# EAGLE design harduino0.1 (EAGLE 7.4.0)
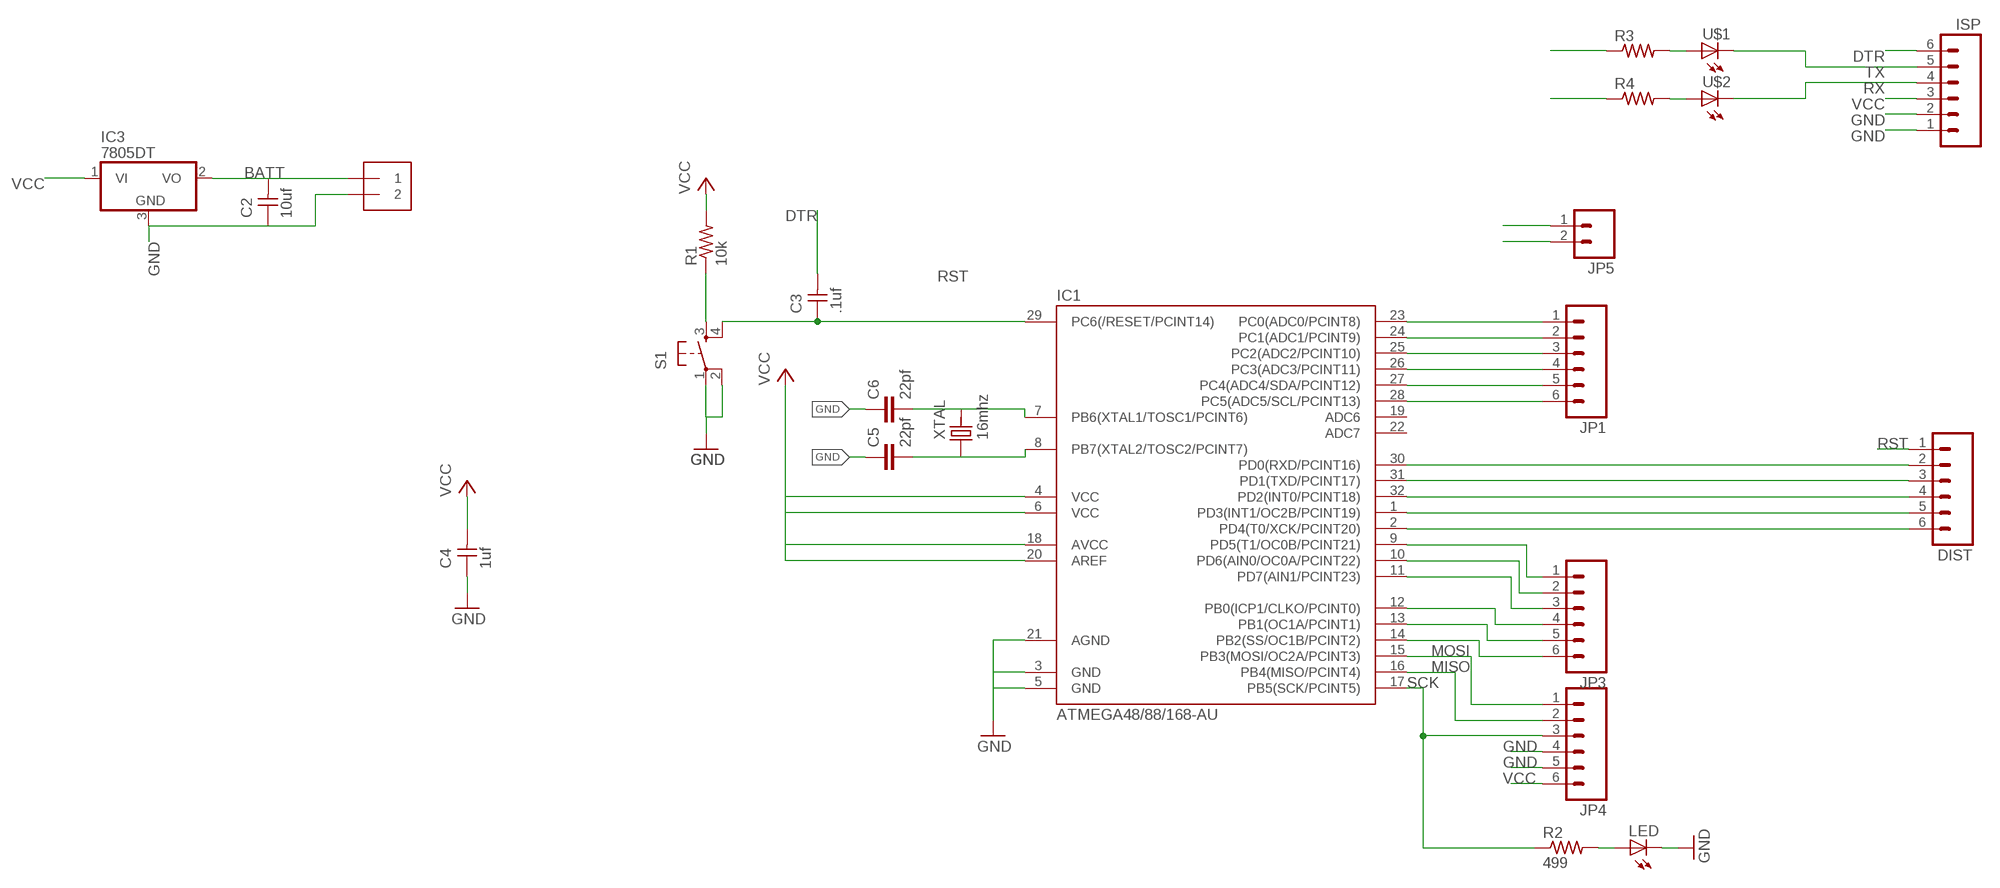
[diagram p0: schematic, sheet 1]

## Parts
C2  10uf  UNPOLARIZED_CAPACITOR1206  [1206]
C3  .1uf  UNPOLARIZED_CAPACITOR1206  [1206]
C4  1uf  UNPOLARIZED_CAPACITOR1206  [1206]
C5  22pf  CAP1206  [1206]
C6  22pf  CAP1206  [1206]
DIST  M06LONGPADS  [1X06_LONGPADS]
IC1  ATMEGA48/88/168-AU  [TQFP32-08]
IC3  7805DT  [TO252]
ISP  M06SMD  [1X06-SMD]
J1  1X2-3.5MM  [3.5MMTERM]
JP1  M06LONGPADS  [1X06_LONGPADS]
JP3  M06LONGPADS  [1X06_LONGPADS]
JP4  M06LONGPADS  [1X06_LONGPADS]
JP5  M02  [1X02_LONGPADS]
LED  LED1206  [1206]
R1  10k  RESISTOR1206  [1206]
R2  499  RESISTOR1206  [1206]
R3  RESISTOR1206  [1206]
R4  RESISTOR1206  [1206]
S1  6MM_SWITCH6MM_SWITCH  [6MM_SWITCH]
U$1  LED1206  [1206]
U$2  LED1206  [1206]
XTAL  16mhz  CRYSTALCS10  [CS10]

## Nets
BATT: C2.2 IC3.2(VO) J1.1
DTR: C3.2 ISP.6
GND: C2.1 C4.1 C5.1 C6.1 IC1.3(GND) IC1.5(GND) IC1.21(AGND) IC3.3(GND) ISP.1 ISP.2 J1.2 JP4.4 JP4.5 JP5.1 LED.2(C) S1.1(P) S1.2(P1)
MISO: IC1.16(PB4(MISO/PCINT4)) JP4.2
MOSI: IC1.15(PB3(MOSI/OC2A/PCINT3)) JP4.1
N$1: C6.2 IC1.7(PB6(XTAL1/TOSC1/PCINT6)) XTAL.P$2
N$2: C5.2 IC1.8(PB7(XTAL2/TOSC2/PCINT7)) XTAL.P$1
N$3: IC1.23(PC0(ADC0/PCINT8)) JP1.1
N$4: IC1.24(PC1(ADC1/PCINT9)) JP1.2
N$5: IC1.25(PC2(ADC2/PCINT10)) JP1.3
N$6: IC1.26(PC3(ADC3/PCINT11)) JP1.4
N$7: IC1.27(PC4(ADC4/SDA/PCINT12)) JP1.5
N$8: IC1.28(PC5(ADC5/SCL/PCINT13)) JP1.6
N$9: DIST.4 IC1.32(PD2(INT0/PCINT18))
N$10: DIST.5 IC1.1(PD3(INT1/OC2B/PCINT19))
N$11: DIST.6 IC1.2(PD4(T0/XCK/PCINT20))
N$12: IC1.9(PD5(T1/OC0B/PCINT21)) JP3.1
N$13: IC1.10(PD6(AIN0/OC0A/PCINT22)) JP3.2
N$14: IC1.11(PD7(AIN1/PCINT23)) JP3.3
N$15: IC1.12(PB0(ICP1/CLKO/PCINT0)) JP3.4
N$16: IC1.13(PB1(OC1A/PCINT1)) JP3.5
N$17: IC1.14(PB2(SS/OC1B/PCINT2)) JP3.6
N$18: DIST.2 IC1.30(PD0(RXD/PCINT16)) R4.1
N$19: R4.2 U$2.1(A)
N$20: R1.1 S1.3(S)
N$21: R3.2 U$1.1(A)
N$23: LED.1(A) R2.2
N$24: DIST.3 IC1.31(PD1(TXD/PCINT17)) R3.1
RST: C3.1 DIST.1 IC1.29(PC6(/RESET/PCINT14)) S1.4(S1)
RX: ISP.4 U$2.2(C)
SCK: IC1.17(PB5(SCK/PCINT5)) JP4.3 R2.1
TX: ISP.5 U$1.2(C)
VCC: C4.2 IC1.4(VCC) IC1.6(VCC) IC1.18(AVCC) IC1.20(AREF) IC3.1(VI) ISP.3 JP4.6 JP5.2 R1.2
Unconnected: IC1.19(ADC6) IC1.22(ADC7)

## Library data of the parts
C2-C4 = ng:UNPOLARIZED_CAPACITOR: unpolarized_capacitor
C5 C6 = 01_SparkFun:CAP: Capacitor Standard 0603 ceramic capacitor, and 0.1" leaded capacitor.
DIST JP1 JP3 JP4 = 01_SparkFun:M06: Header 6 Standard 6-pin 0.1" header. Use with straight break away headers (SKU : PRT-00116), right angle break away headers (PRT-00553), swiss pins (PRT-00743), machine pins (PRT-00117), and female headers (PRT-00115). Molex polarized connector foot print use with SKU : PRT-08094 with associated crimp pins and housings. NOTES ON THE VARIANTS LOCK and LOCK_LONGPADS... This footprint was designed to help hold the alignment of a through-hole component (i.e. 6-pin header) while soldering it into place. You may notice that each hole has been shifted either up or down by 0.005 of an inch from it's more standard position (which is a perfectly straight line). This slight alteration caused the pins (the squares in the middle) to touch the edges of the holes. Because they are alternating, it causes a "brace" to hold the component in place. 0.005 has proven to be the perfect amount of "off-center" position when using our standard breakaway headers. Although looks a little odd when you look at the bare footprint, once you have a header in there, the alteration is very hard to notice. Also, if you push a header all the way into place, it is covered up entirely on the bottom side. This idea of altering the position of holes to aid alignment will be further integrated into the Sparkfun Library for other footprints. It can help hold any component with 3 or more connection pins.
IC1 = atmega8:ATMEGA48/88/168
IC3 = 01_adafruit:78*: Positive VOLTAGE REGULATOR Added bigger pads to the TO-92 package
ISP = SparkFun:M06: Header 6 Standard 6-pin 0.1" header. Use with straight break away headers (SKU : PRT-00116), right angle break away headers (PRT-00553), swiss pins (PRT-00743), machine pins (PRT-00117), and female headers (PRT-00115). Molex polarized connector foot print use with SKU : PRT-08094 with associated crimp pins and housings. NOTES ON THE VARIANTS LOCK and LOCK_LONGPADS... This footprint was designed to help hold the alignment of a through-hole component (i.e. 6-pin header) while soldering it into place. You may notice that each hole has been shifted either up or down by 0.005 of an inch from it's more standard position (which is a perfectly straight line). This slight alteration caused the pins (the squares in the middle) to touch the edges of the holes. Because they are alternating, it causes a "brace" to hold the component in place. 0.005 has proven to be the perfect amount of "off-center" position when using our standard breakaway headers. Although looks a little odd when you look at the bare footprint, once you have a header in there, the alteration is very hard to notice. Also, if you push a header all the way into place, it is covered up entirely on the bottom side. This idea of altering the position of holes to aid alignment will be further integrated into the Sparkfun Library for other footprints. It can help hold any component with 3 or more connection pins.
J1 = 01_adafruit:1X2: 3.5mm Terminal block http://www.ladyada.net/library/pcb/eaglelibrary.html
JP5 = 01_SparkFun:M02: Header 2 Standard 2-pin 0.1" header. Use with straight break away headers (SKU : PRT-00116), right angle break away headers (PRT-00553), swiss pins (PRT-00743), machine pins (PRT-00117), and female headers (PRT-00115). Molex polarized connector foot print use with SKU : PRT-08233 with associated crimp pins and housings.
LED = ng:LED
R1 R2 = ng:RESISTOR
R3 R4 = 01_FAB_Hello:RESISTOR
S1 = ng:6MM_SWITCH: OMRON SWITCH
U$1 U$2 = 01_FAB_Hello:LED
XTAL = 01_ng:CRYSTAL: CRYSTAL

## Board
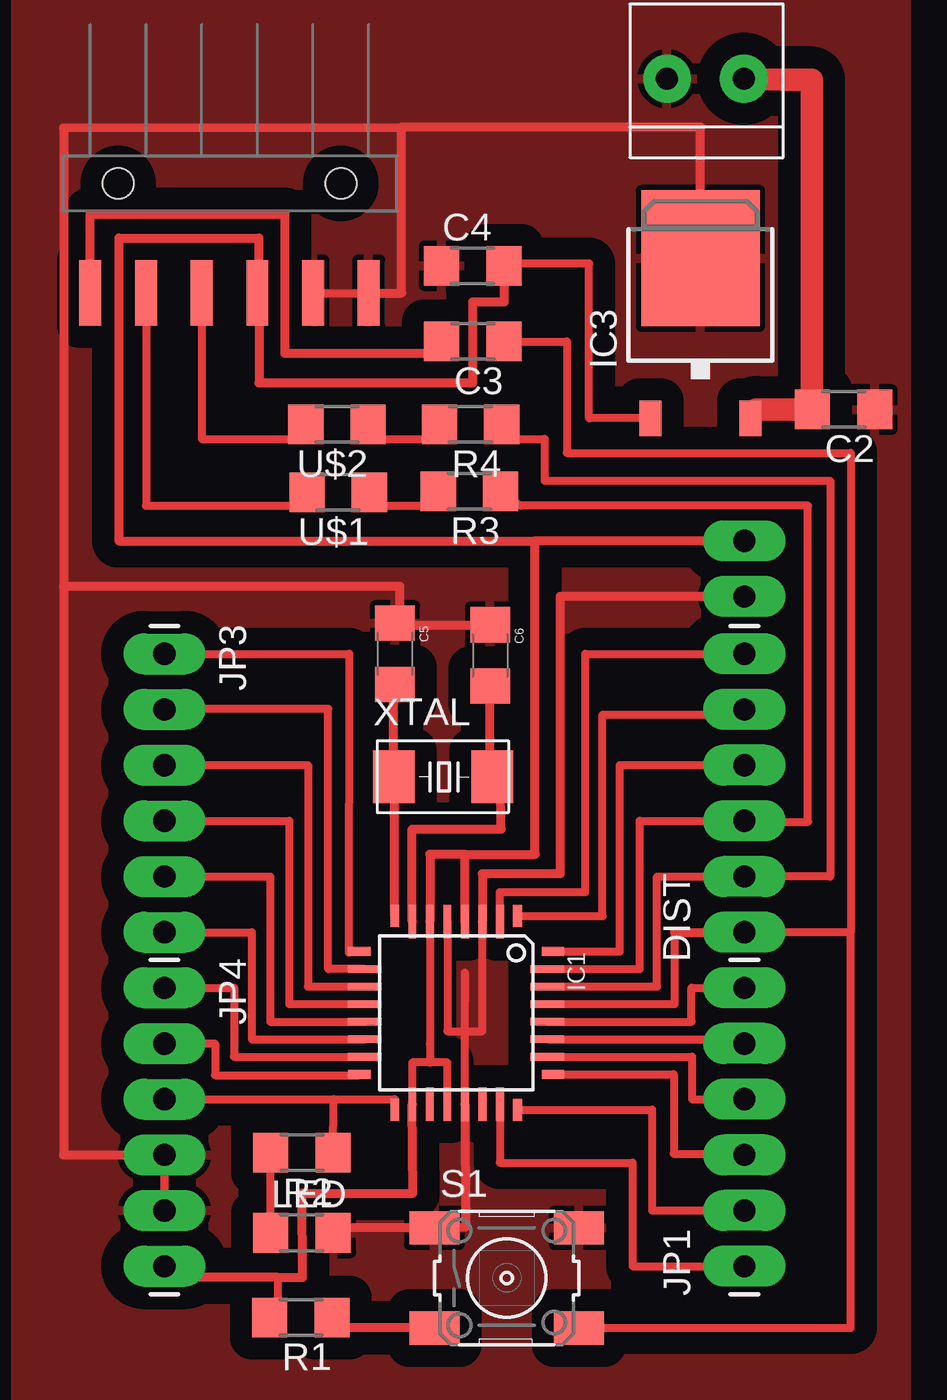
[diagram p1: board, top side]

No outline drawn. Coordinates in mm, seen from the top.
Copper layers (1*16): Top 0.035mm / dielectric 1.5mm / Bottom 0.035mm
Design rules "default *": minimum track width 10mil, minimum drill 24mil, track to track 16mil, track to pad 16mil, pad to pad 16mil, via to via 16mil, smd to smd 16mil, copper to edge 16mil, drill to drill 8mil, minimum pad ring 10mil, minimum via ring 8mil, stop-mask expansion 4mil, vias tented up to drill 0mil, thermal gap 10mil

### Footprints (pad centres in the part's own frame; a part is rotated, then mirrored left to right if it is on the bottom)
1206 = smd 1.6 x 1.803: 1 -1.422,0; 2 1.422,0
1206' = smd 1.6 x 1.8: 1 -1.4,0; 2 1.4,0
1X06_LONGPADS = drill 1.016 pad 1.88 long: 1 0,0; 2 2.54,0; 3 5.08,0; 4 7.62,0; 5 10.16,0; 6 12.7,0
TQFP32-08 = smd 1.016 x 0.406: 1 -4.42,2.8; 8 -4.42,-2.8; 17 4.42,-2.8; 24 4.42,2.8 | smd 1.524 x 0.356: 2 -4.166,2; 3 -4.166,1.2; 4 -4.166,0.4; 5 -4.166,-0.4; 6 -4.166,-1.2; 7 -4.166,-2; 18 4.166,-2; 19 4.166,-1.2; 20 4.166,-0.4; 21 4.166,0.4; 22 4.166,1.2; 23 4.166,2 | smd 0.406 x 1.016: 9 -2.8,-4.42; 16 2.8,-4.42; 25 2.8,4.42; 32 -2.8,4.42 | smd 0.356 x 1.524: 10 -2,-4.166; 11 -1.2,-4.166; 12 -0.4,-4.166; 13 0.4,-4.166; 14 1.2,-4.166; 15 2,-4.166; 26 2,4.166; 27 1.2,4.166; 28 0.4,4.166; 29 -0.4,4.166; 30 -1.2,4.166; 31 -2,4.166
TO252 = smd 1 x 1.6: 1 -2.28,-4.8; 2 2.28,-4.8 | smd 5.4 x 6.2: 3 0,2.5
1X06-SMD = smd 1 x 3: 1 -6.35,5; 2 -3.81,5; 3 -1.27,5; 4 1.27,5; 5 3.81,5; 6 6.35,5 | hole 1.4: -5.08,0; 5.08,0
3.5MMTERM = drill 1 pad 2.184: 1 1.8,0; 2 -1.7,0
1X02_LONGPADS = drill 1.016 pad 1.88 long: 1 0,0; 2 2.54,0
6MM_SWITCH = smd 2.286 x 1.524: 1 -3.302,2.286; 2 3.302,2.286; 3 -3.302,-2.286; 4 3.302,-2.286
CS10 = smd 1.905 x 2.388: P$1 -2.286,0; P$2 2.21,0

### Placement (x,y rotation side)
C2  41.58,48.21 180 top
C3  24.66,51.31 180 top
C4  24.66,54.76 0 top
C5  22pf  [1206']  21.11,37.06 270 top
C6  22pf  [1206']  25.45,36.98 270 top
DIST  37.06,24.36 90 top
IC1  23.9,20.68 270 top
IC3  35.05,52.6 0 top
ISP  13.56,58.52 180 top
J1  35.23,63.3 0 top
JP1  37.06,9.12 90 top
JP3  10.59,37.06 270 top
JP4  10.59,21.82 270 top
JP5  37.06,39.67 90 top
LED  16.87,10.64 0 top
R1  16.81,6.78 180 top
R2  16.87,14.3 180 top
R3  24.51,44.48 180 top
R4  24.56,47.52 180 top
S1  26.21,8.59 0 top
U$1  18.52,44.42 180 top
U$2  18.47,47.52 180 top
XTAL  23.34,31.45 0 top

### Tracks (layer width: path | path; a pad name or v marks a point on that pad's centre or on a via)
BATT
  Top 1.016: IC3.2 37.59,48.21 C2.2 40.13,48.03 40.13,63.25 38.81,63.25 J1.1
DTR
  Top 0.406: ISP.6 7.21,57.12 16.08,57.12 16.08,50.77 23.24,50.77 C3.2
GND
  Top 0.356: ISP.2 ISP.1 | IC1.5 23.5,19.84 24.28,19.84 | 24.28,19.84 25.1,19.84 IC1.3 | IC1.21 24.3,22.51 24.28,19.84 | JP4.5 JP4.4
  Top 0.406: 10.59,11.4 JP4.5 | IC1.21 24.33,10.9 S1.1 18.36,10.87 LED.2 | C5.1 21.33,38.35 21.33,38.38 | JP5.1 28.65,39.67 28.65,27.03 25.1,27.03 IC1.3 | 21.33,38.38 21.33,40.13 5.99,40.13 | 5.99,40.13 5.99,14.2 JP4.4 | 21.33,38.38 C6.1 | 5.99,40.13 5.99,61.06 21.41,61.09 | ISP.1 21.41,53.52 21.41,61.09 | IC3.3 35.05,61.09 21.41,61.09
  pour Top (isolate 1.016): 3.81,68.33 44.45,68.33 44.45,2.54 3.81,2.54
MISO
  Top 0.356: JP4.2 12.9,19.28 12.9,17.83 19.48,17.83 IC1.16
MOSI
  Top 0.356: JP4.1 13.77,21.82 13.77,18.68 IC1.15
N$1
  Top 0.406: IC1.7 21.9,29.06 25.96,29.06 25.93,31.22 | XTAL.P$2 26.06,31.22 25.93,31.22 | 25.93,31.22 25.45,31.22 C6.2
N$2
  Top 0.406: IC1.8 21.1,31.19 XTAL.P$1 21.06,35.66 C5.2
N$3
  Top 0.356: IC1.23 25.9,13.84 31.95,13.84 31.95,9.12 JP1.1
N$4
  Top 0.356: IC1.24 32.84,16.26 32.84,11.66 JP1.2
N$5
  Top 0.356: IC1.25 33.83,17.88 33.83,14.25 37.06,14.25 JP1.3
N$6
  Top 0.356: IC1.26 34.67,18.68 34.67,16.74 JP1.4
N$7
  Top 0.356: IC1.27 36.86,19.48 arc-90 JP1.5
N$8
  Top 0.356: IC1.28 34.65,20.28 34.65,21.82 JP1.6
N$9
  Top 0.356: IC1.32 31.37,23.48 31.37,31.98 DIST.4
N$10
  Top 0.356: IC1.1 30.58,25.09 30.58,34.29 37.06,34.29 DIST.5
N$11
  Top 0.356: IC1.2 25.9,26.19 29.79,26.19 29.79,37.06 DIST.6
N$12
  Top 0.356: JP3.1 19.02,37.06 19,23.43 IC1.9
N$13
  Top 0.356: IC1.10 18.06,22.68 18.06,34.54 10.59,34.54 JP3.2
N$14
  Top 0.356: JP3.3 17.14,31.98 17.14,21.88 IC1.11
N$15
  Top 0.356: JP3.4 16.28,29.44 16.28,21.08 IC1.12
N$16
  Top 0.356: JP3.5 15.42,26.9 15.42,20.28 IC1.13
N$17
  Top 0.356: JP3.6 14.58,24.36 14.58,19.48 IC1.14
N$18
  Top 0.356: IC1.30 33.07,21.88 33.07,26.9 DIST.2 40.97,26.9 40.97,44.96 27.94,44.96 27.94,46.86 26.62,46.86 R4.1
N$19
  Top 0.356: U$2.1 19.89,46.86 23.5,46.86 23.5,47.02 R4.2
N$20
  Top 0.406: S1.3 18.24,6.3 R1.1
N$21
  Top 0.356: 23.34,44.42 R3.2 23.5,44.48 23.5,43.81 19.94,43.81 U$1.1
N$23
  Top 0.356: LED.1 R2.2
N$24
  Top 0.356: IC1.31 32.28,22.68 32.28,29.44 DIST.3 37.11,29.39 39.95,29.39 39.95,43.81 26.85,43.81 R3.1
RST
  Top 0.356: IC1.29 33.88,21.08 33.88,24.36 | C3.1 28.96,51.31 28.96,46.23 41.91,46.23 41.91,24.36 | 41.91,24.36 DIST.1 | S1.4 41.91,6.3 41.91,24.36
  Top 0.406: 33.88,24.36 DIST.1
RX
  Top 0.356: ISP.4 12.29,46.86 17.14,46.86 17.14,47.02 U$2.2
SCK
  Top 0.356: JP4.3 18.31,16.74 | 18.31,16.74 21.1,16.74 IC1.17 | R2.1 18.31,16.74
TX
  Top 0.356: ISP.5 9.75,43.81 16.51,43.81 16.51,44.42 U$1.2
  Top 0.406: 9.96,54.56 ISP.5
VCC
  Top 0.356: IC1.20 23.5,18.41 22.71,18.41 | 22.71,18.41 21.9,18.41 IC1.18 | IC1.6 22.7,19.25 22.71,18.41 | 15.75,8.61 15.75,7.16 R1.2 | IC3.1 29.97,47.8 29.97,54.86 26.09,54.86 C4.2
  Top 0.406: IC1.4 24.3,27.91 | 24.3,27.91 22.7,27.91 IC1.6 | 24.3,27.91 27.51,27.91 27.51,42.22 | IC1.18 21.93,12.45 16.87,12.45 16.89,8.61 15.75,8.61 10.62,8.61 arc90 JP4.6 | ISP.3 14.91,54.16 | 14.91,54.16 14.91,56.03 8.51,56.03 8.51,42.22 27.51,42.22 | 14.91,54.16 14.91,49.43 24.66,49.43 24.66,53.11 26.09,53.11 C4.2 | JP5.2 27.51,42.22